# Altium schematic sheet Ampli_FI2.SchDoc
size A4
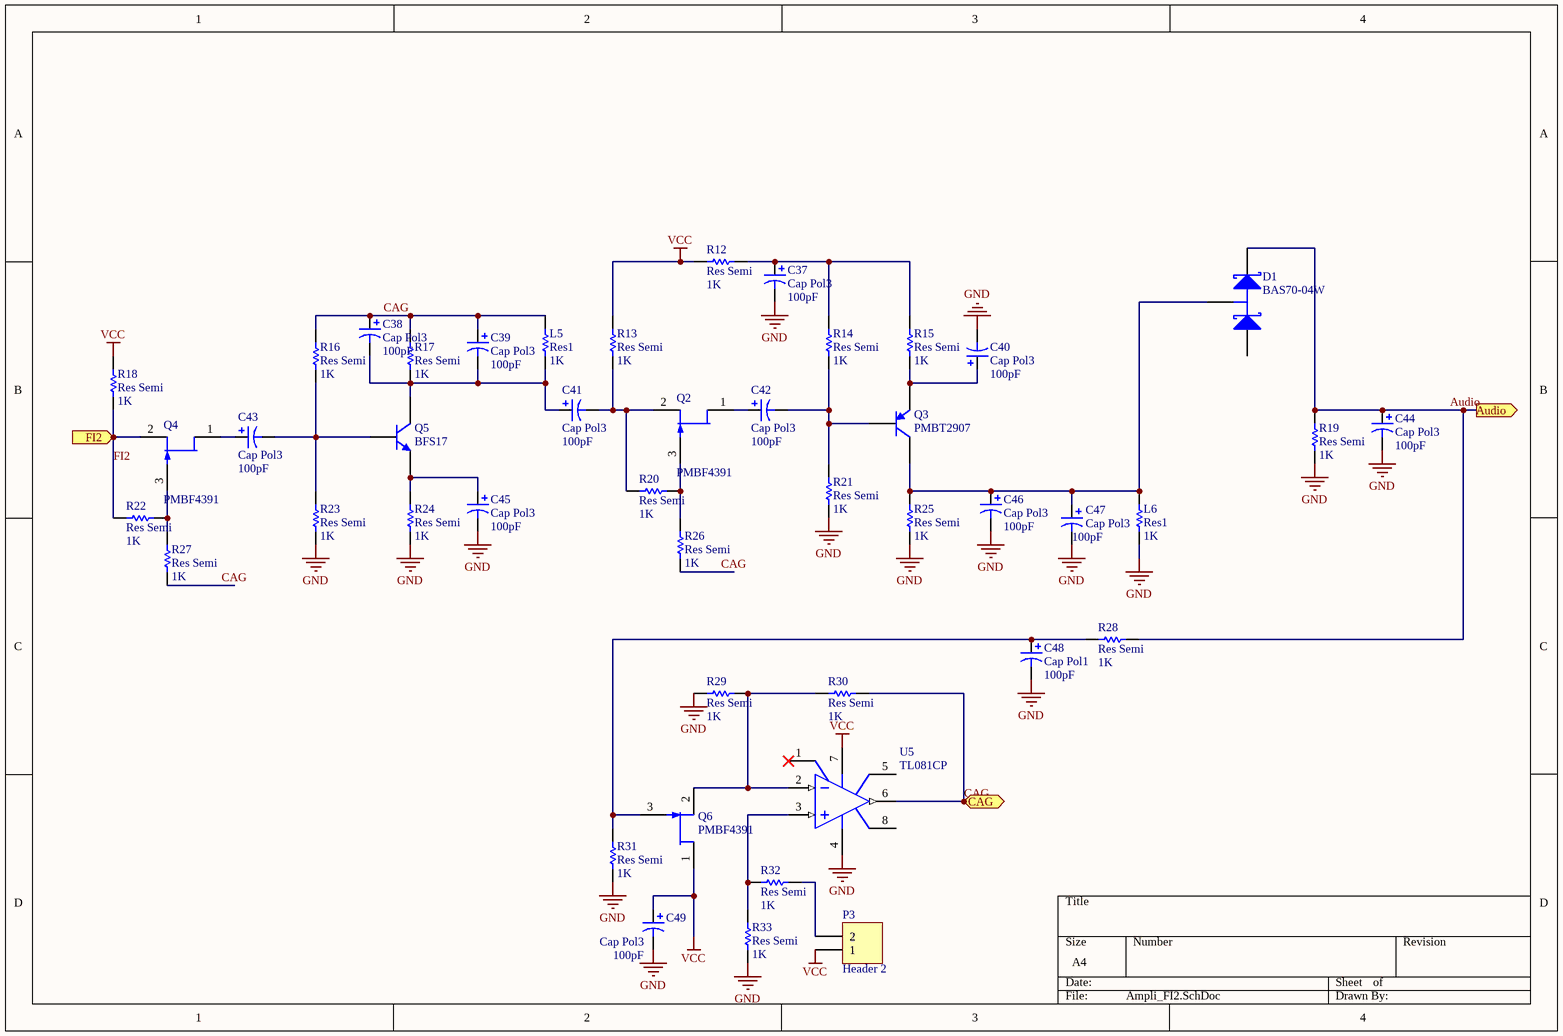
[diagram p0: Ampli_FI2.SchDoc]

## Parts
C37  Cap Pol3  value 100pF  [C0805]
C38  Cap Pol3  value 100pF  [C0805]
C39  Cap Pol3  value 100pF  [C0805]
C40  Cap Pol3  value 100pF  [C0805]
C41  Cap Pol3  value 100pF  [C0805]
C42  Cap Pol3  value 100pF  [C0805]
C43  Cap Pol3  value 100pF  [C0805]
C44  Cap Pol3  value 100pF  [C0805]
C45  Cap Pol3  value 100pF  [C0805]
C46  Cap Pol3  value 100pF  [C0805]
C47  Cap Pol3  value 100pF  [C0805]
C48  Cap Pol1  value 100pF  [B]
C49  Cap Pol3  value 100pF  [C0805]
D1  BAS70-04W  [SOT323_N]
L5  Res1  value 1K  [AXIAL-0.3]
L6  Res1  value 1K  [AXIAL-0.3]
P3  Header 2  [HDR1X2]
Q2  PMBF4391  [SOT23_N]
Q3  PMBT2907  [SOT23_N]
Q4  PMBF4391  [SOT23_N]
Q5  BFS17  [SOT23_N]
Q6  PMBF4391  [SOT23_N]
R12  Res Semi  value 1K  [2012[0805]]
R13  Res Semi  value 1K  [2012[0805]]
R14  Res Semi  value 1K  [2012[0805]]
R15  Res Semi  value 1K  [2012[0805]]
R16  Res Semi  value 1K  [2012[0805]]
R17  Res Semi  value 1K  [2012[0805]]
R18  Res Semi  value 1K  [2012[0805]]
R19  Res Semi  value 1K  [2012[0805]]
R20  Res Semi  value 1K  [2012[0805]]
R21  Res Semi  value 1K  [2012[0805]]
R22  Res Semi  value 1K  [2012[0805]]
R23  Res Semi  value 1K  [2012[0805]]
R24  Res Semi  value 1K  [2012[0805]]
R25  Res Semi  value 1K  [2012[0805]]
R26  Res Semi  value 1K  [2012[0805]]
R27  Res Semi  value 1K  [2012[0805]]
R28  Res Semi  value 1K  [2012[0805]]
R29  Res Semi  value 1K  [2012[0805]]
R30  Res Semi  value 1K  [2012[0805]]
R31  Res Semi  value 1K  [2012[0805]]
R32  Res Semi  value 1K  [2012[0805]]
R33  Res Semi  value 1K  [2012[0805]]
U5  TL081CP  [626-05]

## Ports
Audio (out), CAG (out), FI2 (in)

## Nets
GND: C37.2 C40.2 C44.2 C45.2 C46.2 C47.2 C48.2 C49.2 L6.1 R19.1 R21.2 R23.1 R24.1 R25.2 R29.1 R31.2 R33.2 U5.4(V-)
VCC: C49.1 P3.1 Q6.1(D) R12.2 R13.2 R18.1 U5.7(V+)
Audio: C44.1 D1.2(K) R19.2 R28.1 ; port Audio
CAG: C38.1 C39.1 L5.2 R16.2 R17.2 R26.2 R27.2 R30.2 U5.6(OUT) ; port CAG
FI2: Q4.2(S) R18.2 R22.1 ; port FI2
NetC37_1: C37.1 R12.1 R14.1 R15.1
NetC38_2: C38.2 C39.2 C41.1 L5.1 Q5.3(C) R17.1
NetC40_1: C40.1 Q3.2(E) R15.2
NetC41_2: C41.2 Q2.2(S) R13.1 R20.1
NetC42_1: C42.1 Q2.1(D)
NetC42_2: C42.2 Q3.1(B) R14.2 R21.1
NetC43_1: C43.1 Q4.1(D)
NetC43_2: C43.2 Q5.1(B) R16.1 R23.2
NetC45_1: C45.1 Q5.2(E) R24.2
NetC46_1: C46.1 C47.1 D1.3(C) L6.2 Q3.3(C) R25.1
NetC48_1: C48.1 Q6.3(G) R28.2 R31.1
NetP3_2: P3.2 R32.1
NetQ2_3: Q2.3(G) R20.2 R26.1
NetQ4_3: Q4.3(G) R22.2 R27.1
NetQ6_2: Q6.2(S) R29.2 R30.1 U5.2(IN-)
NetR32_2: R32.2 R33.1 U5.3(IN+)

Not connected (* = marked no-connect by the designer): D1 1(A); U5 1(OS_NULL)* 5(OS_NULL) 8(NC)

## Library data of the parts
C37-C47 C49 = Cap Pol3: Polarized Capacitor (Surface Mount); Published: 8-Jun-2000; LatestRevisionDate: 17-Jul-2002; LatestRevisionNote: Re-released for DXP Platform.; PackageReference: C0805; Publisher: Altium Limited
C48 = Cap Pol1: Polarized Capacitor (Radial); Published: 8-Jun-2000; LatestRevisionDate: 17-Jul-2002; LatestRevisionNote: Re-released for DXP Platform.; PackageReference: RB7.6-15; Publisher: Altium Limited
D1 = BAS70-04W: Schottky Barrier Double Diode; Published: 17-Sep-2003; LatestRevisionDate: 12-Dec-2006; LatestRevisionNote: IPC-7351 Footprint Added.; DatasheetVersion: 26-Mar-1999; PackageVersion: Apr-1999; PackageReference: SOT323; Publisher: Altium Limited; PackageDescription: 3-Pin SOT-323 Package 0.65 mm Pitch, 2.1 mm Lead Span; ComponentLink1Description: Manufacturer Link; ComponentLink1URL: http://www.semiconductors.philips.com/; ComponentLink2Description: Datasheet; ComponentLink2URL: http://www.semiconductors.philips.com/acrobat/datasheets/BAS70W_3.pdf
L5 L6 = Res1: Resistor; Published: 8-Jun-2000; LatestRevisionDate: 17-Jul-2002; LatestRevisionNote: Re-released for DXP Platform.; PackageReference: AXIAL-0.3; Publisher: Altium Limited
P3 = Header 2: Header, 2-Pin; LatestRevisionDate: 17-Jul-2002; LatestRevisionNote: Re-released for DXP Platform.; Publisher: Altium Limited
Q2 Q4 Q6 = PMBF4391: N-channel Silicon Junction Field-effect Transistor; Published: 17-Sep-2003; LatestRevisionDate: 12-Dec-2006; LatestRevisionNote: IPC-7351 Footprint Added.; DatasheetVersion: Apr-1995; PackageVersion: May-1999; PackageReference: SOT23; Publisher: Altium Limited; PackageDescription: 3-Pin SOT-23 Package 0.95 mm Pitch, 2.3 mm Lead Span; ComponentLink1Description: Manufacturer Link; ComponentLink1URL: http://www.semiconductors.philips.com/; ComponentLink2Description: Datasheet; ComponentLink2URL: http://www.semiconductors.philips.com/acrobat/datasheets/PMBF4391_4392_4393_CNV_2.pdf
Q3 = PMBT2907: PNP Switching Transistor; Published: 17-Sep-2003; LatestRevisionDate: 12-Dec-2006; LatestRevisionNote: IPC-7351 Footprint Added.; DatasheetVersion: 27-Apr-1999; PackageVersion: May-1999; PackageReference: SOT23; Publisher: Altium Limited; PackageDescription: 3-Pin SOT-23 Package 0.95 mm Pitch, 2.3 mm Lead Span; ComponentLink1Description: Manufacturer Link; ComponentLink1URL: http://www.semiconductors.philips.com/; ComponentLink2Description: Datasheet; ComponentLink2URL: http://www.semiconductors.philips.com/acrobat/datasheets/PMBT2907_PMBT2907A_5.pdf
Q5 = BFS17: NPN 1 GHz Wideband Transistor; Published: 17-Sep-2003; LatestRevisionDate: 12-Dec-2006; LatestRevisionNote: IPC-7351 Footprint Added.; DatasheetVersion: Sep-1995; PackageVersion: May-1999; PackageReference: SOT23; Publisher: Altium Limited; PackageDescription: 3-Pin SOT-23 Package 0.95 mm Pitch, 2.3 mm Lead Span; ComponentLink1Description: Manufacturer Link; ComponentLink1URL: http://www.semiconductors.philips.com/; ComponentLink2Description: Datasheet; ComponentLink2URL: http://www.semiconductors.philips.com/acrobat/datasheets/BFS17_2.pdf
R12-R33 = Res Semi: Semiconductor Resistor; Published: 8-Jun-2000; LatestRevisionDate: 17-Jul-2002; LatestRevisionNote: Re-released for DXP Platform.; PackageReference: AXIAL-0.5; Publisher: Altium Limited
U5 = TL081CP: JFET-Input Operational Amplifier; Published: 17-Jul-2002; LatestRevisionDate: 06-Jun-2005; LatestRevisionNote: Stylized 3D Model Added.; DatasheetVersion: 1988; PackageReference: 626-05; Publisher: Altium Limited; PackageDescription: DIP; 8 Leads; Row Spacing 7.62 mm; Pitch 2.54 mm; ComponentLink1Description: Manufacturer Link; ComponentLink1URL: http://www.onsemi.com/site/products/parametrics/0,4446,251,00.html